# Altium schematic sheet Effects.SchDoc
size A4; Organization: Altium Limited; Address1: L3, 12a Rodborough Rd; Address2: Frenchs Forest; Address3: NSW; Address4: Australia 2086; DocumentNumber: 2; SheetNumber: 2; SheetTotal: 8
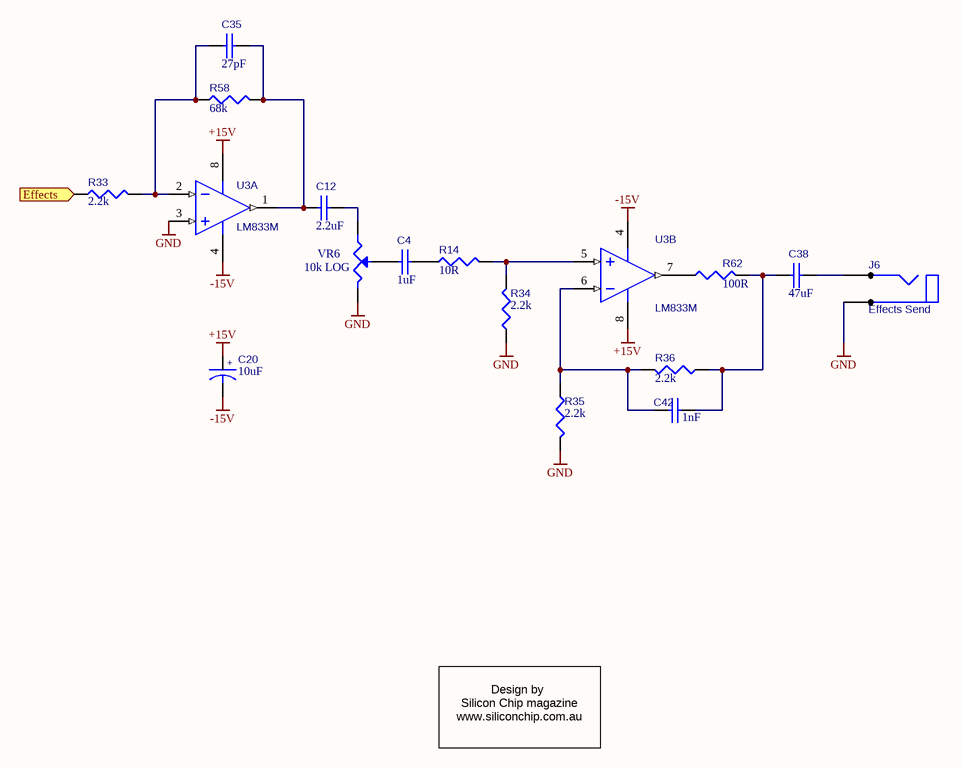
[diagram p0: Effects.SchDoc]

## Parts
C4  1uF  [RB.2/.4-NP]
C12  2.2uF  [RB.2/.4-NP]
C20  10uF  [RB.2/.4]
C35  27pF  [RAD0.2]
C38  47uF  [RB.2/.4-NP]
C42  1nF  [RAD0.2]
J6  Effects Send  [JACK-6.25MM]
R14  10R  [AXIAL0.4]
R33  2.2k  [AXIAL0.4]
R34  2.2k  [AXIAL0.4]
R35  2.2k  [AXIAL0.4]
R36  2.2k  [AXIAL0.4]
R58  68k  [AXIAL0.4]
R62  100R  [AXIAL0.4]
U3  LM833M  [DIP8]  (parts A,B of 2)
VR6  10k LOG  [POT - 24MM]

## Ports
Effects (in)

## Nets
+15V: C20.1 U3.8(V+)
-15V: C20.2 U3.4(V-)
GND: J6.3(C) R34.1 R35.2 U3.3(IN1+) VR6.3
Effects: R33.1 ; port Effects
NetC4_1: C4.1 VR6.2(W)
NetC4_2: C4.2 R14.1
NetC12_1: C12.1 C35.2 R58.2 U3.1(OUT1)
NetC12_2: C12.2 VR6.1
NetC35_1: C35.1 R33.2 R58.1 U3.2(IN1-)
NetC38_1: C38.1 C42.2 R36.1 R62.2
NetC38_2: C38.2 J6.1(A)
NetC42_1: C42.1 R35.1 R36.2 U3.6(IN2-)
NetR14_2: R14.2 R34.2 U3.5(IN2+)
NetR62_1: R62.1 U3.7(OUT2)

## Notes on the sheet
- Design by
  Silicon Chip magazine
  www.siliconchip.com.au
- Title
- Size:
- Date:
- A4
- Number:
- Time:
- Revision:
- Sheet
- of
- File:
- (in symbol CAPACITOR POL) +

## Library data of the parts
C4 C12 C35 C38 C42 = CAP: Capacitor
  C42: Value: 1nF
C20 = CAPACITOR POL: Bi-Polar Capacitor; Value: 10uF
J6 = PHONEJACK MONO
R14 R33-R36 R58 R62 = RES1: Resistor
  R14: Value: 10R
  R33-R36: Value: 2.2k
  R58: Value: 68k
  R62: Value: 100R
U3 = LM833M: Fast Settling Dual Operational Amplifier
VR6 = POT1: Potentiometer